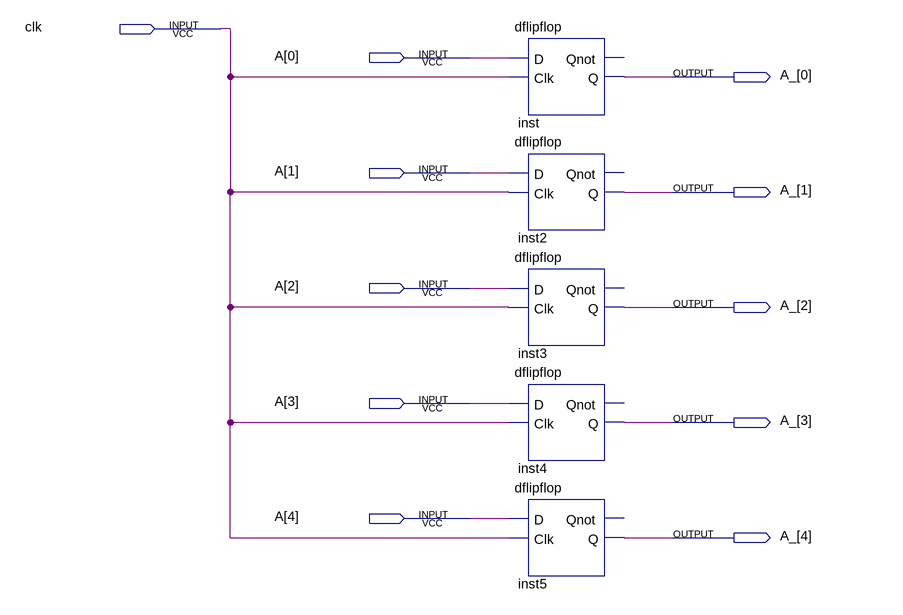
[diagram p0: schematic sheet]
// Quartus schematic 5bitregister.bdf as structural Verilog: 5 symbols, 11 pins
module \5bitregister  (
  input  clk,
  input  [4:0] A,
  output [4:0] A_
);

  dflipflop inst (.D(A[0]), .Clk(clk), .Q(A_[0]));  // open: Qnot
  dflipflop inst2 (.D(A[1]), .Clk(clk), .Q(A_[1]));  // open: Qnot
  dflipflop inst3 (.D(A[2]), .Clk(clk), .Q(A_[2]));  // open: Qnot
  dflipflop inst4 (.D(A[3]), .Clk(clk), .Q(A_[3]));  // open: Qnot
  dflipflop inst5 (.D(A[4]), .Clk(clk), .Q(A_[4]));  // open: Qnot
endmodule
